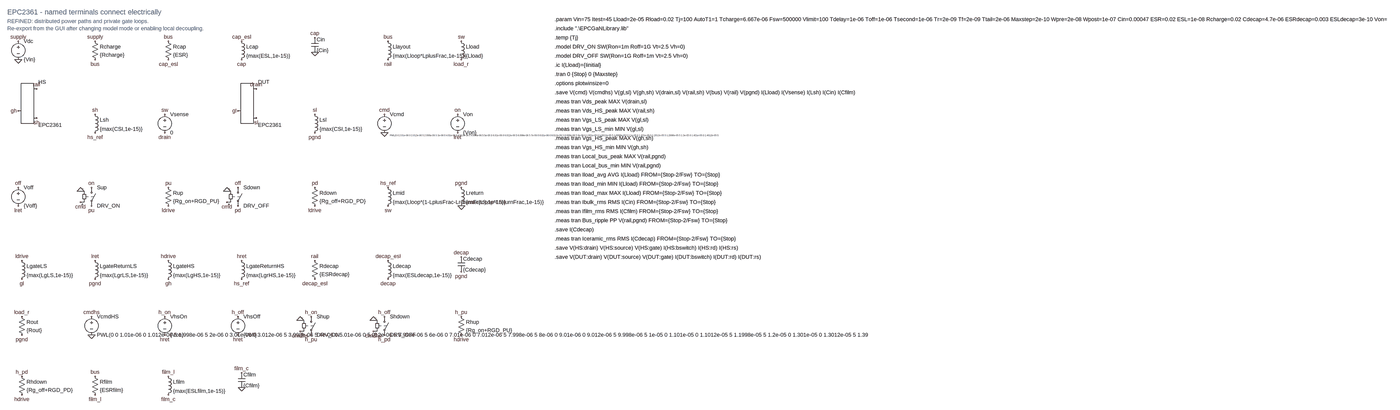
[diagram p0: schematic DPT-EPC.asc, whole sheet]
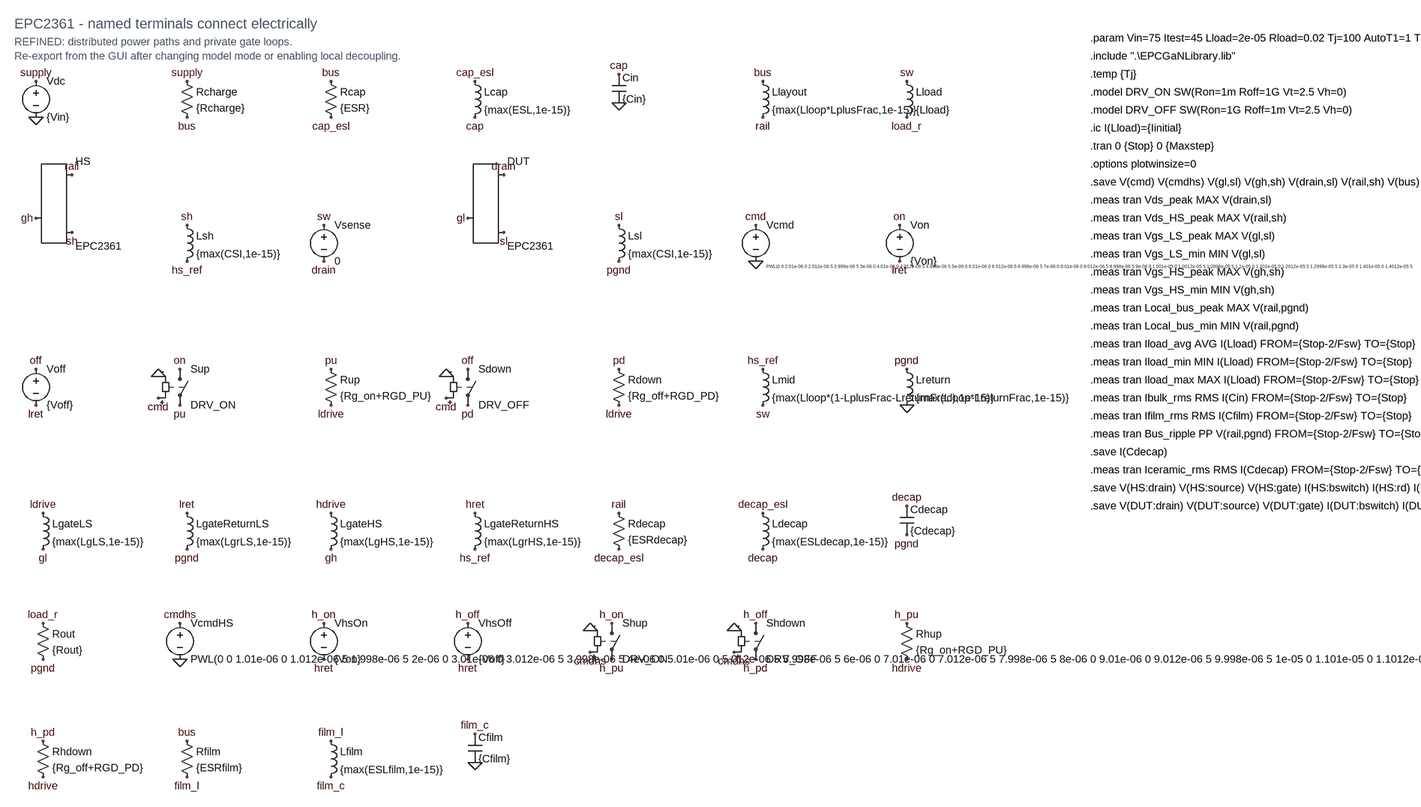
[diagram p1: schematic DPT-EPC.asc, part, row 1 of 1, column 1 of 2]
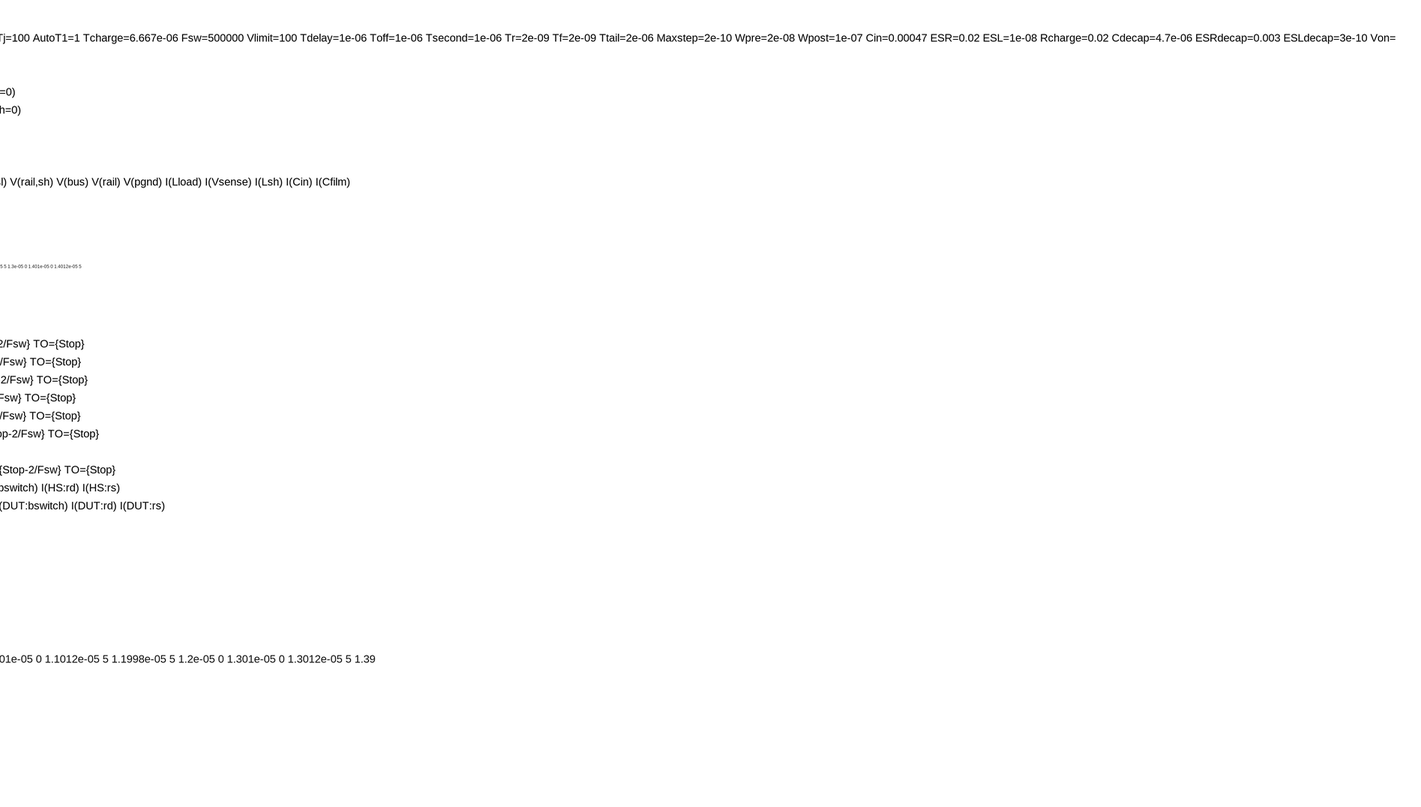
[diagram p2: schematic DPT-EPC.asc, part, row 1 of 1, column 2 of 2]
DPT-EPC.asc, the LTspice schematic file:
Version 4
SHEET 1 4400 2400
TEXT 48 0 Left 3 ;EPC2361 - named terminals connect electrically
TEXT 48 40 Left 2 ;REFINED: distributed power paths and private gate loops.
TEXT 48 72 Left 2 ;Re-export from the GUI after changing model mode or enabling local decoupling.
SYMBOL voltage 96 112 R0
SYMATTR InstName Vdc
SYMATTR Value {Vin}
FLAG 96 128 supply
FLAG 96 208 0
SYMBOL res 416 112 R0
SYMATTR InstName Rcharge
SYMATTR Value {Rcharge}
FLAG 432 128 supply
FLAG 432 208 bus
SYMBOL res 736 112 R0
SYMATTR InstName Rcap
SYMATTR Value {ESR}
FLAG 752 128 bus
FLAG 752 208 cap_esl
SYMBOL ind 1056 112 R0
SYMATTR InstName Lcap
SYMATTR Value {max(ESL,1e-15)}
SYMATTR SpiceLine Rser=0
FLAG 1072 128 cap_esl
FLAG 1072 208 cap
SYMBOL cap 1376 112 R0
SYMATTR InstName Cin
SYMATTR Value {Cin}
FLAG 1392 112 cap
FLAG 1392 176 0
SYMBOL ind 1696 112 R0
SYMATTR InstName Llayout
SYMATTR Value {max(Lloop*LplusFrac,1e-15)}
SYMATTR SpiceLine Rser={Rloop*RplusFrac}
FLAG 1712 128 bus
FLAG 1712 208 rail
SYMBOL ind 2016 112 R0
SYMATTR InstName Lload
SYMATTR Value {Lload}
SYMATTR SpiceLine Rser={Rload}
FLAG 2032 128 sw
FLAG 2032 208 load_r
SYMBOL EPCGaN 96 432 R0
SYMATTR InstName HS
SYMATTR Value EPC2361
SYMATTR ModelFile .\EPCGaNLibrary.lib
FLAG 96 432 gh
FLAG 176 336 rail
FLAG 176 464 sh
SYMBOL ind 416 432 R0
SYMATTR InstName Lsh
SYMATTR Value {max(CSI,1e-15)}
SYMATTR SpiceLine Rser={RCSI}
FLAG 432 448 sh
FLAG 432 528 hs_ref
SYMBOL voltage 736 432 R0
SYMATTR InstName Vsense
SYMATTR Value 0
FLAG 736 448 sw
FLAG 736 528 drain
SYMBOL EPCGaN 1056 432 R0
SYMATTR InstName DUT
SYMATTR Value EPC2361
SYMATTR ModelFile .\EPCGaNLibrary.lib
FLAG 1056 432 gl
FLAG 1136 336 drain
FLAG 1136 464 sl
SYMBOL ind 1376 432 R0
SYMATTR InstName Lsl
SYMATTR Value {max(CSI,1e-15)}
SYMATTR SpiceLine Rser={RCSI}
FLAG 1392 448 sl
FLAG 1392 528 pgnd
SYMBOL voltage 1696 432 R0
WINDOW 3 24 108 Left 0
SYMATTR InstName Vcmd
SYMATTR Value PWL(0 0 2.01e-06 0 2.012e-06 5 2.998e-06 5 3e-06 0 4.01e-06 0 4.012e-06 5 4.998e-06 5 5e-06 0 6.01e-06 0 6.012e-06 5 6.998e-06 5 7e-06 0 8.01e-06 0 8.012e-06 5 8.998e-06 5 9e-06 0 1.001e-05 0 1.0012e-05 5 1.0998e-05 5 1.1e-05 0 1.201e-05 0 1.2012e-05 5 1.2998e-05 5 1.3e-05 0 1.401e-05 0 1.4012e-05 5 1.4998e-05 5 1.5e-05 0 1.601e-05 0 1.6012e-05 5 1.6998e-05 5 1.7e-05 0 1.801e-05 0 1.8012e-05 5 1.8998e-05 5 1.9e-05 0 2.001e-05 0 2.0012e-05 5 2.0998e-05 5 2.1e-05 0 2.201e-05 0 2.2012e-05 5 2.2998e-05 5 2.3e-05 0 2.401e-05 0 2.4012e-05 5 2.4998e-05 5 2.5e-05 0 2.601e-05 0 2.6012e-05 5 2.6998e-05 5 2.7e-05 0 2.801e-05 0 2.8012e-05 5 2.8998e-05 5 2.9e-05 0 3.001e-05 0 3.0012e-05 5 3.0998e-05 5 3.1e-05 0 3.201e-05 0 3.2012e-05 5 3.2998e-05 5 3.3e-05 0 3.401e-05 0 3.4012e-05 5 3.4998e-05 5 3.5e-05 0 3.601e-05 0 3.6012e-05 5 3.6998e-05 5 3.7e-05 0 3.801e-05 0 3.8012e-05 5 3.8998e-05 5 3.9e-05 0 4.001e-05 0 4.0012e-05 5 4.0998e-05 5 4.1e-05 0)
FLAG 1696 448 cmd
FLAG 1696 528 0
SYMBOL voltage 2016 432 R0
SYMATTR InstName Von
SYMATTR Value {Von}
FLAG 2016 448 on
FLAG 2016 528 lret
SYMBOL voltage 96 752 R0
SYMATTR InstName Voff
SYMATTR Value {Voff}
FLAG 96 768 off
FLAG 96 848 lret
SYMBOL sw 416 752 R0
SYMATTR InstName Sup
SYMATTR Value DRV_ON
FLAG 416 768 on
FLAG 416 848 pu
FLAG 368 832 cmd
FLAG 368 784 0
SYMBOL res 736 752 R0
SYMATTR InstName Rup
SYMATTR Value {Rg_on+RGD_PU}
FLAG 752 768 pu
FLAG 752 848 ldrive
SYMBOL sw 1056 752 R0
SYMATTR InstName Sdown
SYMATTR Value DRV_OFF
FLAG 1056 768 off
FLAG 1056 848 pd
FLAG 1008 832 cmd
FLAG 1008 784 0
SYMBOL res 1376 752 R0
SYMATTR InstName Rdown
SYMATTR Value {Rg_off+RGD_PD}
FLAG 1392 768 pd
FLAG 1392 848 ldrive
SYMBOL ind 1696 752 R0
SYMATTR InstName Lmid
SYMATTR Value {max(Lloop*(1-LplusFrac-LreturnFrac),1e-15)}
SYMATTR SpiceLine Rser={Rloop*max(1-RplusFrac-RreturnFrac,0)}
FLAG 1712 768 hs_ref
FLAG 1712 848 sw
SYMBOL ind 2016 752 R0
SYMATTR InstName Lreturn
SYMATTR Value {max(Lloop*LreturnFrac,1e-15)}
SYMATTR SpiceLine Rser={Rloop*RreturnFrac}
FLAG 2032 768 pgnd
FLAG 2032 848 0
SYMBOL ind 96 1072 R0
SYMATTR InstName LgateLS
SYMATTR Value {max(LgLS,1e-15)}
SYMATTR SpiceLine Rser={RgTraceLS}
FLAG 112 1088 ldrive
FLAG 112 1168 gl
SYMBOL ind 416 1072 R0
SYMATTR InstName LgateReturnLS
SYMATTR Value {max(LgrLS,1e-15)}
SYMATTR SpiceLine Rser={RgrLS}
FLAG 432 1088 lret
FLAG 432 1168 pgnd
SYMBOL ind 736 1072 R0
SYMATTR InstName LgateHS
SYMATTR Value {max(LgHS,1e-15)}
SYMATTR SpiceLine Rser={RgTraceHS}
FLAG 752 1088 hdrive
FLAG 752 1168 gh
SYMBOL ind 1056 1072 R0
SYMATTR InstName LgateReturnHS
SYMATTR Value {max(LgrHS,1e-15)}
SYMATTR SpiceLine Rser={RgrHS}
FLAG 1072 1088 hret
FLAG 1072 1168 hs_ref
SYMBOL res 1376 1072 R0
SYMATTR InstName Rdecap
SYMATTR Value {ESRdecap}
FLAG 1392 1088 rail
FLAG 1392 1168 decap_esl
SYMBOL ind 1696 1072 R0
SYMATTR InstName Ldecap
SYMATTR Value {max(ESLdecap,1e-15)}
SYMATTR SpiceLine Rser=0
FLAG 1712 1088 decap_esl
FLAG 1712 1168 decap
SYMBOL cap 2016 1072 R0
SYMATTR InstName Cdecap
SYMATTR Value {Cdecap}
FLAG 2032 1072 decap
FLAG 2032 1136 pgnd
SYMBOL res 96 1392 R0
SYMATTR InstName Rout
SYMATTR Value {Rout}
FLAG 112 1408 load_r
FLAG 112 1488 pgnd
SYMBOL voltage 416 1392 R0
SYMATTR InstName VcmdHS
SYMATTR Value PWL(0 0 1.01e-06 0 1.012e-06 5 1.998e-06 5 2e-06 0 3.01e-06 0 3.012e-06 5 3.998e-06 5 4e-06 0 5.01e-06 0 5.012e-06 5 5.998e-06 5 6e-06 0 7.01e-06 0 7.012e-06 5 7.998e-06 5 8e-06 0 9.01e-06 0 9.012e-06 5 9.998e-06 5 1e-05 0 1.101e-05 0 1.1012e-05 5 1.1998e-05 5 1.2e-05 0 1.301e-05 0 1.3012e-05 5 1.3998e-05 5 1.4e-05 0 1.501e-05 0 1.5012e-05 5 1.5998e-05 5 1.6e-05 0 1.701e-05 0 1.7012e-05 5 1.7998e-05 5 1.8e-05 0 1.901e-05 0 1.9012e-05 5 1.9998e-05 5 2e-05 0 2.101e-05 0 2.1012e-05 5 2.1998e-05 5 2.2e-05 0 2.301e-05 0 2.3012e-05 5 2.3998e-05 5 2.4e-05 0 2.501e-05 0 2.5012e-05 5 2.5998e-05 5 2.6e-05 0 2.701e-05 0 2.7012e-05 5 2.7998e-05 5 2.8e-05 0 2.901e-05 0 2.9012e-05 5 2.9998e-05 5 3e-05 0 3.101e-05 0 3.1012e-05 5 3.1998e-05 5 3.2e-05 0 3.301e-05 0 3.3012e-05 5 3.3998e-05 5 3.4e-05 0 3.501e-05 0 3.5012e-05 5 3.5998e-05 5 3.6e-05 0 3.701e-05 0 3.7012e-05 5 3.7998e-05 5 3.8e-05 0 3.901e-05 0 3.9012e-05 5 3.9998e-05 5 4e-05 0)
FLAG 416 1408 cmdhs
FLAG 416 1488 0
SYMBOL voltage 736 1392 R0
SYMATTR InstName VhsOn
SYMATTR Value {Von}
FLAG 736 1408 h_on
FLAG 736 1488 hret
SYMBOL voltage 1056 1392 R0
SYMATTR InstName VhsOff
SYMATTR Value {Voff}
FLAG 1056 1408 h_off
FLAG 1056 1488 hret
SYMBOL sw 1376 1392 R0
SYMATTR InstName Shup
SYMATTR Value DRV_ON
FLAG 1376 1408 h_on
FLAG 1376 1488 h_pu
FLAG 1328 1472 cmdhs
FLAG 1328 1424 0
SYMBOL sw 1696 1392 R0
SYMATTR InstName Shdown
SYMATTR Value DRV_OFF
FLAG 1696 1408 h_off
FLAG 1696 1488 h_pd
FLAG 1648 1472 cmdhs
FLAG 1648 1424 0
SYMBOL res 2016 1392 R0
SYMATTR InstName Rhup
SYMATTR Value {Rg_on+RGD_PU}
FLAG 2032 1408 h_pu
FLAG 2032 1488 hdrive
SYMBOL res 96 1712 R0
SYMATTR InstName Rhdown
SYMATTR Value {Rg_off+RGD_PD}
FLAG 112 1728 h_pd
FLAG 112 1808 hdrive
SYMBOL res 416 1712 R0
SYMATTR InstName Rfilm
SYMATTR Value {ESRfilm}
FLAG 432 1728 bus
FLAG 432 1808 film_l
SYMBOL ind 736 1712 R0
SYMATTR InstName Lfilm
SYMATTR Value {max(ESLfilm,1e-15)}
SYMATTR SpiceLine Rser=0
FLAG 752 1728 film_l
FLAG 752 1808 film_c
SYMBOL cap 1056 1712 R0
SYMATTR InstName Cfilm
SYMATTR Value {Cfilm}
FLAG 1072 1712 film_c
FLAG 1072 1776 0
TEXT 2440 32 Left 2 !.param Vin=75 Itest=45 Lload=2e-05 Rload=0.02 Tj=100 AutoT1=1 Tcharge=6.667e-06 Fsw=500000 Vlimit=100 Tdelay=1e-06 Toff=1e-06 Tsecond=1e-06 Tr=2e-09 Tf=2e-09 Ttail=2e-06 Maxstep=2e-10 Wpre=2e-08 Wpost=1e-07 Cin=0.00047 ESR=0.02 ESL=1e-08 Rcharge=0.02 Cdecap=4.7e-06 ESRdecap=0.003 ESLdecap=3e-10 Von=5 Voff=-1 Rg_on=1 Rg_off=0 RGD_PU=0.7 RGD_PD=0.4 Rg_HS=0.4 Refined=1 Lloop=6e-10 Rloop=0.005 CSI=1e-10 RCSI=0.0001 LplusFrac=0.5 LreturnFrac=0.5 RplusFrac=0.5 RreturnFrac=0.5 LgLS=5e-10 LgrLS=5e-10 RgTraceLS=0.02 RgrLS=0.02 LgHS=5e-10 LgrHS=5e-10 RgTraceHS=0.02 RgrHS=0.02 LossVth=1.5 Mode=1 Duty=0.5 Deadtime=1e-08 Cycles=20 Rout=0.8133333333 Iinitial=45 Cfilm=2.2e-05 ESRfilm=0.005 ESLfilm=3e-09 Stop=4.1e-05
TEXT 2440 72 Left 2 !.include ".\EPCGaNLibrary.lib"
TEXT 2440 112 Left 2 !.temp {Tj}
TEXT 2440 152 Left 2 !.model DRV_ON SW(Ron=1m Roff=1G Vt=2.5 Vh=0)
TEXT 2440 192 Left 2 !.model DRV_OFF SW(Ron=1G Roff=1m Vt=2.5 Vh=0)
TEXT 2440 232 Left 2 !.ic I(Lload)={Iinitial}
TEXT 2440 272 Left 2 !.tran 0 {Stop} 0 {Maxstep}
TEXT 2440 312 Left 2 !.options plotwinsize=0
TEXT 2440 352 Left 2 !.save V(cmd) V(cmdhs) V(gl,sl) V(gh,sh) V(drain,sl) V(rail,sh) V(bus) V(rail) V(pgnd) I(Lload) I(Vsense) I(Lsh) I(Cin) I(Cfilm)
TEXT 2440 392 Left 2 !.meas tran Vds_peak MAX V(drain,sl)
TEXT 2440 432 Left 2 !.meas tran Vds_HS_peak MAX V(rail,sh)
TEXT 2440 472 Left 2 !.meas tran Vgs_LS_peak MAX V(gl,sl)
TEXT 2440 512 Left 2 !.meas tran Vgs_LS_min MIN V(gl,sl)
TEXT 2440 552 Left 2 !.meas tran Vgs_HS_peak MAX V(gh,sh)
TEXT 2440 592 Left 2 !.meas tran Vgs_HS_min MIN V(gh,sh)
TEXT 2440 632 Left 2 !.meas tran Local_bus_peak MAX V(rail,pgnd)
TEXT 2440 672 Left 2 !.meas tran Local_bus_min MIN V(rail,pgnd)
TEXT 2440 712 Left 2 !.meas tran Iload_avg AVG I(Lload) FROM={Stop-2/Fsw} TO={Stop}
TEXT 2440 752 Left 2 !.meas tran Iload_min MIN I(Lload) FROM={Stop-2/Fsw} TO={Stop}
TEXT 2440 792 Left 2 !.meas tran Iload_max MAX I(Lload) FROM={Stop-2/Fsw} TO={Stop}
TEXT 2440 832 Left 2 !.meas tran Ibulk_rms RMS I(Cin) FROM={Stop-2/Fsw} TO={Stop}
TEXT 2440 872 Left 2 !.meas tran Ifilm_rms RMS I(Cfilm) FROM={Stop-2/Fsw} TO={Stop}
TEXT 2440 912 Left 2 !.meas tran Bus_ripple PP V(rail,pgnd) FROM={Stop-2/Fsw} TO={Stop}
TEXT 2440 952 Left 2 !.save I(Cdecap)
TEXT 2440 992 Left 2 !.meas tran Iceramic_rms RMS I(Cdecap) FROM={Stop-2/Fsw} TO={Stop}
TEXT 2440 1032 Left 2 !.save V(HS:drain) V(HS:source) V(HS:gate) I(HS:bswitch) I(HS:rd) I(HS:rs)
TEXT 2440 1072 Left 2 !.save V(DUT:drain) V(DUT:source) V(DUT:gate) I(DUT:bswitch) I(DUT:rd) I(DUT:rs)

The netlist it stands for:
* DPT-EPC.asc
Vdc supply 0 {Vin}
Rcharge supply bus {Rcharge}
Rcap bus cap_esl {ESR}
Lcap cap_esl cap {max(ESL,1e-15)} Rser=0
Cin cap 0 {Cin}
Llayout bus rail {max(Lloop*LplusFrac,1e-15)} Rser={Rloop*RplusFrac}
Lload sw load_r {Lload} Rser={Rload}
XHS gh rail sh EPC2361
Lsh sh hs_ref {max(CSI,1e-15)} Rser={RCSI}
Vsense sw drain 0
XDUT gl drain sl EPC2361
Lsl sl pgnd {max(CSI,1e-15)} Rser={RCSI}
Vcmd cmd 0 PWL(0 0 2.01e-06 0 2.012e-06 5 2.998e-06 5 3e-06 0 4.01e-06 0 4.012e-06 5 4.998e-06 5 5e-06 0 6.01e-06 0 6.012e-06 5 6.998e-06 5 7e-06 0 8.01e-06 0 8.012e-06 5 8.998e-06 5 9e-06 0 1.001e-05 0 1.0012e-05 5 1.0998e-05 5 1.1e-05 0 1.201e-05 0 1.2012e-05 5 1.2998e-05 5 1.3e-05 0 1.401e-05 0 1.4012e-05 5 1.4998e-05 5 1.5e-05 0 1.601e-05 0 1.6012e-05 5 1.6998e-05 5 1.7e-05 0 1.801e-05 0 1.8012e-05 5 1.8998e-05 5 1.9e-05 0 2.001e-05 0 2.0012e-05 5 2.0998e-05 5 2.1e-05 0 2.201e-05 0 2.2012e-05 5 2.2998e-05 5 2.3e-05 0 2.401e-05 0 2.4012e-05 5 2.4998e-05 5 2.5e-05 0 2.601e-05 0 2.6012e-05 5 2.6998e-05 5 2.7e-05 0 2.801e-05 0 2.8012e-05 5 2.8998e-05 5 2.9e-05 0 3.001e-05 0 3.0012e-05 5 3.0998e-05 5 3.1e-05 0 3.201e-05 0 3.2012e-05 5 3.2998e-05 5 3.3e-05 0 3.401e-05 0 3.4012e-05 5 3.4998e-05 5 3.5e-05 0 3.601e-05 0 3.6012e-05 5 3.6998e-05 5 3.7e-05 0 3.801e-05 0 3.8012e-05 5 3.8998e-05 5 3.9e-05 0 4.001e-05 0 4.0012e-05 5 4.0998e-05 5 4.1e-05 0)
Von on lret {Von}
Voff off lret {Voff}
Sup on pu cmd 0 DRV_ON
Rup pu ldrive {Rg_on+RGD_PU}
Sdown off pd cmd 0 DRV_OFF
Rdown pd ldrive {Rg_off+RGD_PD}
Lmid hs_ref sw {max(Lloop*(1-LplusFrac-LreturnFrac),1e-15)} Rser={Rloop*max(1-RplusFrac-RreturnFrac,0)}
Lreturn pgnd 0 {max(Lloop*LreturnFrac,1e-15)} Rser={Rloop*RreturnFrac}
LgateLS ldrive gl {max(LgLS,1e-15)} Rser={RgTraceLS}
LgateReturnLS lret pgnd {max(LgrLS,1e-15)} Rser={RgrLS}
LgateHS hdrive gh {max(LgHS,1e-15)} Rser={RgTraceHS}
LgateReturnHS hret hs_ref {max(LgrHS,1e-15)} Rser={RgrHS}
Rdecap rail decap_esl {ESRdecap}
Ldecap decap_esl decap {max(ESLdecap,1e-15)} Rser=0
Cdecap decap pgnd {Cdecap}
Rout load_r pgnd {Rout}
VcmdHS cmdhs 0 PWL(0 0 1.01e-06 0 1.012e-06 5 1.998e-06 5 2e-06 0 3.01e-06 0 3.012e-06 5 3.998e-06 5 4e-06 0 5.01e-06 0 5.012e-06 5 5.998e-06 5 6e-06 0 7.01e-06 0 7.012e-06 5 7.998e-06 5 8e-06 0 9.01e-06 0 9.012e-06 5 9.998e-06 5 1e-05 0 1.101e-05 0 1.1012e-05 5 1.1998e-05 5 1.2e-05 0 1.301e-05 0 1.3012e-05 5 1.3998e-05 5 1.4e-05 0 1.501e-05 0 1.5012e-05 5 1.5998e-05 5 1.6e-05 0 1.701e-05 0 1.7012e-05 5 1.7998e-05 5 1.8e-05 0 1.901e-05 0 1.9012e-05 5 1.9998e-05 5 2e-05 0 2.101e-05 0 2.1012e-05 5 2.1998e-05 5 2.2e-05 0 2.301e-05 0 2.3012e-05 5 2.3998e-05 5 2.4e-05 0 2.501e-05 0 2.5012e-05 5 2.5998e-05 5 2.6e-05 0 2.701e-05 0 2.7012e-05 5 2.7998e-05 5 2.8e-05 0 2.901e-05 0 2.9012e-05 5 2.9998e-05 5 3e-05 0 3.101e-05 0 3.1012e-05 5 3.1998e-05 5 3.2e-05 0 3.301e-05 0 3.3012e-05 5 3.3998e-05 5 3.4e-05 0 3.501e-05 0 3.5012e-05 5 3.5998e-05 5 3.6e-05 0 3.701e-05 0 3.7012e-05 5 3.7998e-05 5 3.8e-05 0 3.901e-05 0 3.9012e-05 5 3.9998e-05 5 4e-05 0)
VhsOn h_on hret {Von}
VhsOff h_off hret {Voff}
Shup h_on h_pu cmdhs 0 DRV_ON
Shdown h_off h_pd cmdhs 0 DRV_OFF
Rhup h_pu hdrive {Rg_on+RGD_PU}
Rhdown h_pd hdrive {Rg_off+RGD_PD}
Rfilm bus film_l {ESRfilm}
Lfilm film_l film_c {max(ESLfilm,1e-15)} Rser=0
Cfilm film_c 0 {Cfilm}
* EPC2361 - named terminals connect electrically
* REFINED: distributed power paths and private gate loops.
* Re-export from the GUI after changing model mode or enabling local decoupling.
.param Vin=75 Itest=45 Lload=2e-05 Rload=0.02 Tj=100 AutoT1=1 Tcharge=6.667e-06 Fsw=500000 Vlimit=100 Tdelay=1e-06 Toff=1e-06 Tsecond=1e-06 Tr=2e-09 Tf=2e-09 Ttail=2e-06 Maxstep=2e-10 Wpre=2e-08 Wpost=1e-07 Cin=0.00047 ESR=0.02 ESL=1e-08 Rcharge=0.02 Cdecap=4.7e-06 ESRdecap=0.003 ESLdecap=3e-10 Von=5 Voff=-1 Rg_on=1 Rg_off=0 RGD_PU=0.7 RGD_PD=0.4 Rg_HS=0.4 Refined=1 Lloop=6e-10 Rloop=0.005 CSI=1e-10 RCSI=0.0001 LplusFrac=0.5 LreturnFrac=0.5 RplusFrac=0.5 RreturnFrac=0.5 LgLS=5e-10 LgrLS=5e-10 RgTraceLS=0.02 RgrLS=0.02 LgHS=5e-10 LgrHS=5e-10 RgTraceHS=0.02 RgrHS=0.02 LossVth=1.5 Mode=1 Duty=0.5 Deadtime=1e-08 Cycles=20 Rout=0.8133333333 Iinitial=45 Cfilm=2.2e-05 ESRfilm=0.005 ESLfilm=3e-09 Stop=4.1e-05
.include ".\EPCGaNLibrary.lib"
.temp {Tj}
.model DRV_ON SW(Ron=1m Roff=1G Vt=2.5 Vh=0)
.model DRV_OFF SW(Ron=1G Roff=1m Vt=2.5 Vh=0)
.ic I(Lload)={Iinitial}
.tran 0 {Stop} 0 {Maxstep}
.options plotwinsize=0
.save V(cmd) V(cmdhs) V(gl,sl) V(gh,sh) V(drain,sl) V(rail,sh) V(bus) V(rail) V(pgnd) I(Lload) I(Vsense) I(Lsh) I(Cin) I(Cfilm)
.meas tran Vds_peak MAX V(drain,sl)
.meas tran Vds_HS_peak MAX V(rail,sh)
.meas tran Vgs_LS_peak MAX V(gl,sl)
.meas tran Vgs_LS_min MIN V(gl,sl)
.meas tran Vgs_HS_peak MAX V(gh,sh)
.meas tran Vgs_HS_min MIN V(gh,sh)
.meas tran Local_bus_peak MAX V(rail,pgnd)
.meas tran Local_bus_min MIN V(rail,pgnd)
.meas tran Iload_avg AVG I(Lload) FROM={Stop-2/Fsw} TO={Stop}
.meas tran Iload_min MIN I(Lload) FROM={Stop-2/Fsw} TO={Stop}
.meas tran Iload_max MAX I(Lload) FROM={Stop-2/Fsw} TO={Stop}
.meas tran Ibulk_rms RMS I(Cin) FROM={Stop-2/Fsw} TO={Stop}
.meas tran Ifilm_rms RMS I(Cfilm) FROM={Stop-2/Fsw} TO={Stop}
.meas tran Bus_ripple PP V(rail,pgnd) FROM={Stop-2/Fsw} TO={Stop}
.save I(Cdecap)
.meas tran Iceramic_rms RMS I(Cdecap) FROM={Stop-2/Fsw} TO={Stop}
.save V(HS:drain) V(HS:source) V(HS:gate) I(HS:bswitch) I(HS:rd) I(HS:rs)
.save V(DUT:drain) V(DUT:source) V(DUT:gate) I(DUT:bswitch) I(DUT:rd) I(DUT:rs)
.lib .\EPCGaNLibrary.lib
.backanno
.end